# Altium schematic sheet Button_input.SchDoc
size A; SheetNumber: 6; SheetTotal: 10
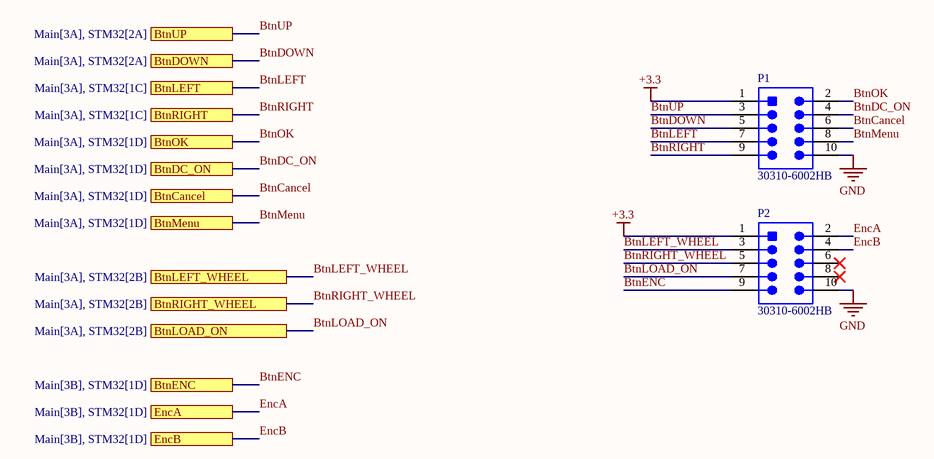
[diagram p0: Button_input.SchDoc]

## Parts
P1  30310-6002HB  [3M-30310-6002HB-10_V]
P2  30310-6002HB  [3M-30310-6002HB-10_V]

## Ports
BtnCancel (see Main[3A], STM32[1D]), BtnDC_ON (see Main[3A], STM32[1D]), BtnDOWN (see Main[3A], STM32[2A]), BtnENC (see Main[3B], STM32[1D]), BtnLEFT (see Main[3A], STM32[1C]), BtnLEFT_WHEEL (see Main[3A], STM32[2B]), BtnLOAD_ON (see Main[3A], STM32[2B]), BtnMenu (see Main[3A], STM32[1D]), BtnOK (see Main[3A], STM32[1D]), BtnRIGHT (see Main[3A], STM32[1C]), BtnRIGHT_WHEEL (see Main[3A], STM32[2B]), BtnUP (see Main[3A], STM32[2A]), EncA (see Main[3B], STM32[1D]), EncB (see Main[3B], STM32[1D])

## Nets
+3.3: P1.1 P2.1
GND: P1.10 P2.10
BtnCancel: P1.6 ; port BtnCancel
BtnDC_ON: P1.4 ; port BtnDC_ON
BtnDOWN: P1.5 ; port BtnDOWN
BtnENC: P2.9 ; port BtnENC
BtnLEFT: P1.7 ; port BtnLEFT
BtnLEFT_WHEEL: P2.3 ; port BtnLEFT_WHEEL
BtnLOAD_ON: P2.7 ; port BtnLOAD_ON
BtnMenu: P1.8 ; port BtnMenu
BtnOK: P1.2 ; port BtnOK
BtnRIGHT: P1.9 ; port BtnRIGHT
BtnRIGHT_WHEEL: P2.5 ; port BtnRIGHT_WHEEL
BtnUP: P1.3 ; port BtnUP
EncA: P2.2 ; port EncA
EncB: P2.4 ; port EncB

Not connected (* = marked no-connect by the designer): P2 6* 8*

## Library data of the parts
P1 P2 = CMP-2000-05031-1: Male Header, Pitch 2.54 mm, 2 x 5 Position, Height 9.3 mm, Tail Length 2.79 mm, -55 to 105 degC, RoHS, Bulk; Manufacturer: 3M; Current Rating: 1A; Brand: 3MElectronicSolutionsDivision; Mounting Angle: Straight; Number of Positions: 10Position; Mating Post Length: 5.99mm; Pitch: 2.54mm; Manufacturer URL: http://www.3m.com/; Factory Pack Quantity: 1000; Mounting Style: StraightPin; Number of Rows: 2Row; Termination Post Length: 2.79mm; Contact Gender: Pin(Male); Contact Material: Brass; Termination Style: ThroughHole; Product: Headers; Packaging: Tray; Product Category: Headers&WireHousings; Type: Shrouded; Datasheet URL: http://datasheet.octopart.com/30310-6002HB-3M-datasheet-11537585.pdf; Datasheet Version: Apr-12; Contact Plating: Gold; Row Spacing: 2.54mm; Housing Material: Polyester; Series: 303; RoHS: Details